# Altium schematic sheet Power Supply.SchDoc
size A4
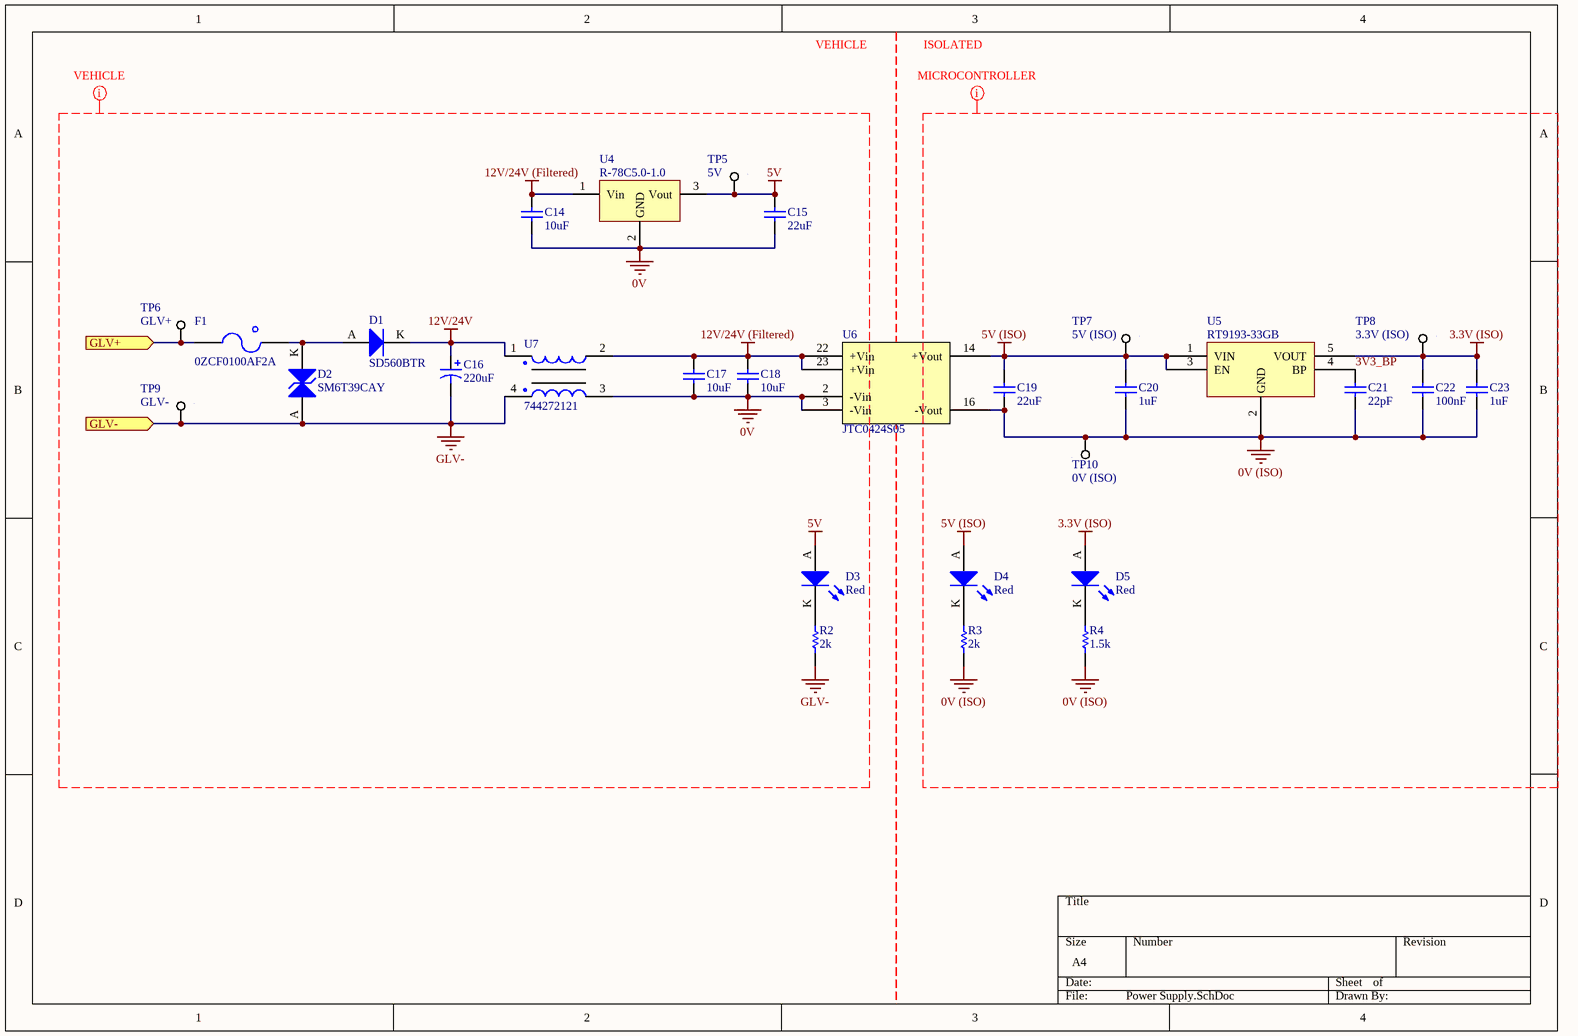
[diagram p0: Power Supply.SchDoc]

## Parts
C14  10uF  [0805]
C15  22uF  [1206]
C16  220uF  [Vishay Radial 1213]
C17  10uF  [0805]
C18  10uF  [0805]
C19  22uF  [1206]
C20  1uF  [0805]
C21  22pF  [0805]
C22  100nF  [0805]
C23  1uF  [0805]
D1  SD560BTR  [SMB Diode]
D2  SM6T39CAY  [ST SMB Diode]
D3  Red  [0805 LED]
D4  Red  [0805 LED]
D5  Red  [0805 LED]
F1  0ZCF0100AF2A  [2920]
R2  2k  [0805]
R3  2k  [0805]
R4  1.5k  [0805]
TP5  5V  [SMD Test Point 1mm]
TP6  GLV+  [SMD Test Point 1mm]
TP7  5V (ISO)  [SMD Test Point 1mm]
TP8  3.3V (ISO)  [SMD Test Point 1mm]
TP9  GLV-  [SMD Test Point 1mm]
TP10  0V (ISO)  [SMD Test Point 1mm]
U4  R-78C5.0-1.0  [RECOM 3-SIP]
U5  RT9193-33GB  [RICHTEK SOT-23-5]
U6  JTC0424S05  [24-DIP Module, 7 Leads]
U7  744272121  [Wurth 4-PC Pad]

## Ports
GLV+ (in), GLV- (in)

## Nets
0V: C14.1 C15.1 C17.1 C18.1 U4.2(GND) U6.2(-Vin) U6.3(-Vin) U7.3
0V (ISO): C19.1 C20.1 C21.1 C22.1 C23.1 R3.1 R4.1 TP10.1 U5.2(GND) U6.16(-Vout)
3.3V (ISO): C22.2 C23.2 D5.A TP8.1 U5.5(VOUT)
5V: C15.2 D3.A TP5.1 U4.3(Vout)
5V (ISO): C19.2 C20.2 D4.A TP7.1 U5.1(VIN) U5.3(EN) U6.14(+Vout)
12V/24V: C16.2 D1.K U7.1
12V/24V (Filtered): C14.2 C17.2 C18.2 U4.1(Vin) U6.22(+Vin) U6.23(+Vin) U7.2
GLV-: C16.1 D2.A R2.1 TP9.1 U7.4 ; port GLV-
3V3_BP: C21.2 U5.4(BP)
GLV+: F1.1 TP6.1 ; port GLV+
NetD1_A: D1.A D2.K F1.2
NetD3_K: D3.K R2.2
NetD4_K: D4.K R3.2
NetD5_K: D5.K R4.2

## Layout directives
net class VEHICLE: 0V, 5V, 12V/24V, 12V/24V (Filtered), GLV-
net class MICROCONTROLLER: 0V (ISO), 3.3V (ISO), 3V3_BP, 5V (ISO)

## Notes on the sheet
- VEHICLE
- ISOLATED

## Library data of the parts
C14 C17 C18 = GRM21BR6YA106KE43L: Manufacturer: muRata; Tolerance: 10%; Material: X5R; Rated Voltage: 50V; Part Number: GRM21BR6YA106KE43L; Value: 10uF; Digikey Part Number: 490-10514-6-ND
C15 C19 = CC1206MKX5R7BB226: Manufacturer: YAGEO; Tolerance: 20%; Material: Ceramic; Rated Voltage: 16V; Part Number: CC1206MKX5R7BB226; Value: 22uF; Digikey Part Number: 311-1997-2-ND
C16 = MAL214699106E3: Manufacturer: Vishay; Tolerance: 20%; Material: Aluminium Electrolytic; Rated Voltage: 50V; Part Number: MAL214699106E3; Value: 220uF; Digikey Part Number: 4440PHCT-ND
C20 C23 = AC0805KKX7R8BB105: Manufacturer: YAGEO; Tolerance: 10%; Material: X7R; Rated Voltage: 25V; Part Number: AC0805KKX7R8BB105; Value: 1uF; Digikey Part Number: DO NOT USE FOR NEW DESIGNS
C21 = GRM21A5C2E220JW01D: Manufacturer: muRata; Tolerance: ±5%; Material: C0G, NP0; Rated Voltage: 250V; Part Number: GRM21A5C2E220JW01D; Value: 22pF; Digikey Part Number: 490-5534-1-ND
C22 = GCM21BR71H104KA37L: Manufacturer: muRata; Tolerance: ±10%; Material: X7R; Rated Voltage: 50V; Part Number: GCM21BR71H104KA37L; Value: 100nF; Digikey Part Number: 490-6064-1-ND
D1 = SD560BTR: 1.2V_F 600V 5A SMB; Manufacturer: SMC Diode Solutions; Part Number: SD560BTR; Digikey Part Number: 1655-1530-2-ND; Digikey Link: https://www.digikey.com/product-detail/en/smc-diode-solutions/SD560BTR/1655-1530-2-ND/6022620
D2 = SM6T39CAY: 42.8V Clamp 93A (8/20µs) Ipp Tvs Diode Surface Mount SMB (DO-214AA); Manufacturer: ST; Vf: 42.8; Part Number: SM6T39CAY; Vbr: 42.8V; Digikey Part Number: SM6T39CAY; Digikey Link: https://www.digikey.com/en/products/detail/stmicroelectronics/SM6T39CAY/2442903; Alternative Parts: https://www.digikey.com/en/products/detail/stmicroelectronics/SM6T39AY/2442901
D3-D5 = SML-210LTT86: Red LED Indication - Discrete 1.75V 0805 (2012 Metric); Manufacturer: ROHM Semiconductor; Part Number: SML-210LTT86; Colour: Red; Digikey Part Number: 511-1286-1-ND; Digikey Link: https://www.digikey.com/product-detail/en/rohm-semiconductor/SML-210LTT86/511-1286-1-ND/637099
F1 = 0ZCF0100AF2A: PTC RESET FUSE 60V 1A 292; Manufacturer: Littelfuse Inc.; Part Number: 0ZCF0100AF2A; Digikey Part Number: 507-2070-1-ND; Digikey Link: https://www.digikey.com/product-detail/en/bel-fuse-inc/0ZCF0100AF2A/507-2070-1-ND/6210547
R2 R3 = RC0805FR072KL: Manufacturer: YAGEO; Tolerance: 0.01; Rated Voltage: 0.125W; Part Number: RC0805FR072KL; Value: 2k; Material: FR-07; Digikey Part Number: 311-2.00KCRCT-ND
R4 = RC0805FR071K5L: Manufacturer: YAGEO; Tolerance: 0.01; Rated Voltage: 0.125W; Part Number: RC0805FR071K5L; Value: 1.5k; Material: FR-07; Digikey Part Number: 311-1.50KCRCT-ND
TP5-TP10 = SMD Test Point Small: Positions: 1; Pitch: 0mm; Row Spacing: 0; Flange: No; Contact: NA; Part Number: SMD Test Point Small; Angle: 0
U4 = R-78C5.0-1.0: CONV DC/DC 1A 5V OUT SIP VERT; Manufacturer: Recom; Isolation: Non-Isolated; Output Power: 5W; Part Number: R-78C5.0-1.0; Digikey Part Number: 945-1395-5-ND; Digikey Link: https://www.digikey.com.au/product-detail/en/recom-power/R-78C5.0-1.0/945-1395-5-ND/2652148; Output Voltage: 5V
U5 = RT9193-33GB: Linear Voltage Regulator IC 1 Output 300mA SOT-23-5; Manufacturer: Richtek; Input Voltage: 5.5V-0.3V; Output Voltage: 3.3V; Output Power: 1W; Efficiency: 0.5; Isolation: Non-Isolated; Part Number: RT9193-33GB; Digikey Part Number: 1028-1014-1-ND; Digikey Link: https://www.digikey.com/products/en?keywords=1028-1014-1-ND
U6 = JTC0424S05: DC DC CONVERTER 5V 4W; Manufacturer: XP Power; Input Voltage: 9V-36V; Efficiency: 0.79; Isolation: Isolated; Part Number: JTC0424S05; Output Voltage: 5V; Output Power: 4W; Digikey Part Number: JTC0424S05-ND; Digikey Link: https://www.digikey.com/products/en?keywords=%20JTC0424S05
U7 = 744272121: 120µH @ 100kHz 2 Line Common Mode Choke Surface Mount 460 Ohms @ 30MHz 2.5A DCR 25mOhm; Manufacturer: Wurth Electronics Inc; Value: 120uH @ 100kHz; Part Number: 744272121; Impedence: 460 Ohms @ 30MHz; Material: Wirewound; Rated Current: 2.5A; Digikey Part Number: 732-1489-1-ND; Digikey Link: https://www.digikey.com/product-detail/en/w-rth-elektronik/744272121/732-1489-1-ND/1639501